# EAGLE design esp_switch (EAGLE 8.0.2)
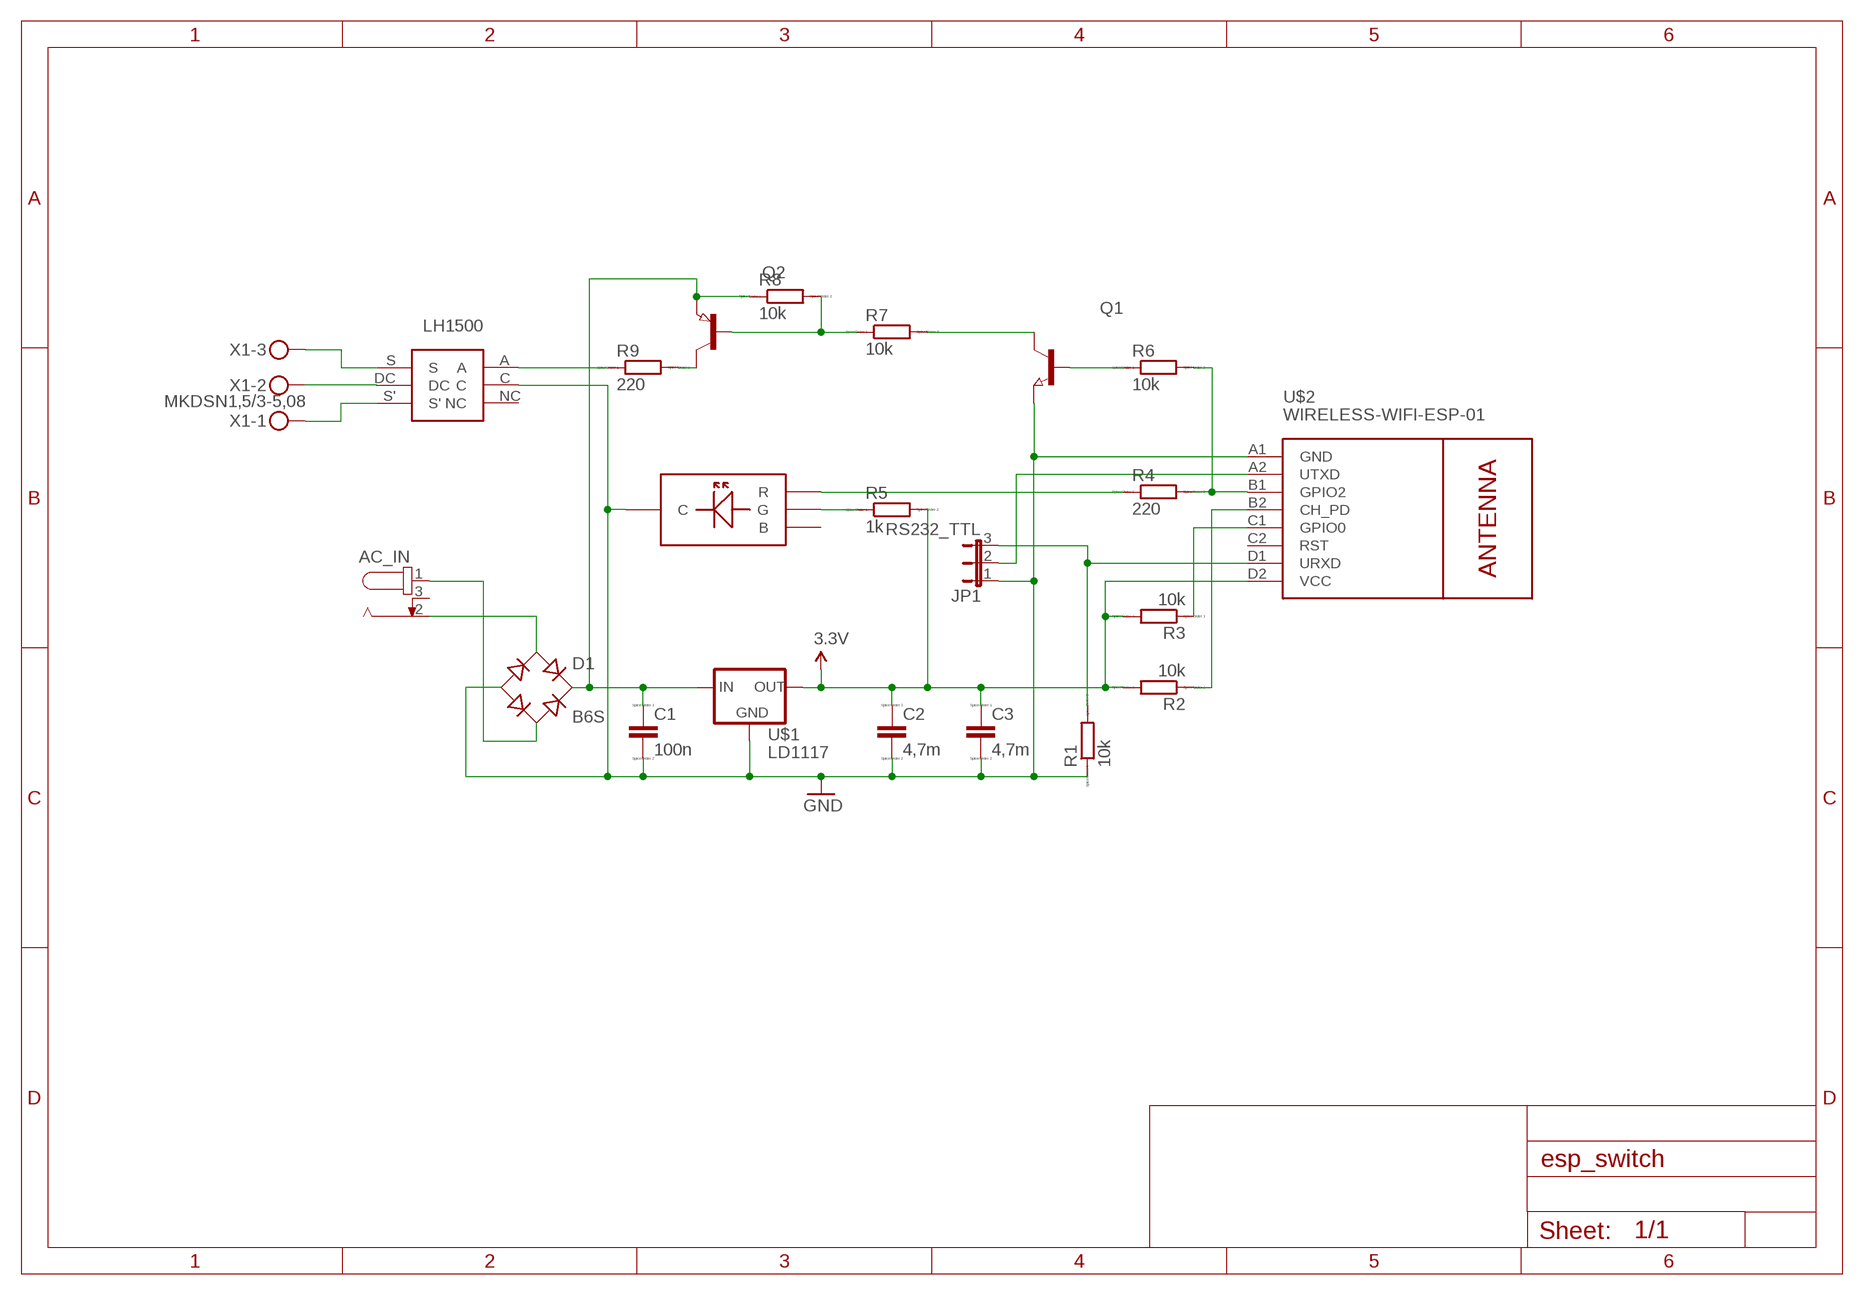
[diagram p0: schematic, sheet 1]

## Parts
AC_IN  694108301002  [694108301002]
C1  100n  C  [C0805]
C2  4,7m  C  [C0805]
C3  4,7m  C  [C0805]
D1  B6S  [MBS]
JP1  RS232_TTL  JP2E  [JP2]
LH1500  LH1500  [LH1500]
Q1  NPN-TRANSISTOR_SOT23  [SOT23]
Q2  PNP-TRANSISTOR_SOT23  [SOT23]
R1  10k  R  [R0805]
R2  10k  R  [R0805]
R3  10k  R  [R0805]
R4  220  R  [R0805]
R5  1k  R  [R0805]
R6  10k  R  [R0805]
R7  10k  R  [R0805]
R8  10k  R  [R0805]
R9  220  R  [R0805]
RGBLED5MM  RGB_LEDA  [RGB_LED]
U$1  LD1117  [LD1117]
U$2  WIRELESS-WIFI-ESP-01  [WIRELESS-WIFI-ESP-01]
X1  MKDSN1,5/3-5,08  [MKDSN1,5/3-5,08]

## Nets
3.3V: C2.1 C3.1 R2.2 R3.2 R5.2 U$1.OUT U$2.D2(VCC)
GND: C1.2 C2.2 C3.2 D1.- JP1.1 LH1500.C Q1.2(E) R1.1 RGBLED5MM.P$3(C) U$1.GND U$2.A1(GND)
N$1: AC_IN.2 D1.AC1
N$2: LH1500.S X1.3
N$3: AC_IN.1 D1.AC2
N$4: JP1.3 R1.2 U$2.D1(URXD)
N$5: JP1.2 U$2.A2(UTXD)
N$6: C1.1 D1.+ Q2.2(E) R8.1 U$1.IN
N$7: LH1500.DC X1.2
N$8: R3.1 U$2.C1(GPIO0)
N$9: R2.1 U$2.B2(CH_PD)
N$10: R4.2 R6.2 U$2.B1(GPIO2)
N$11: R5.1 RGBLED5MM.P$2(G)
N$12: R4.1 RGBLED5MM.P$4(R)
N$13: Q2.3(C) R9.2
N$14: LH1500.S' X1.1
N$15: Q2.1(B) R7.1 R8.2
N$16: Q1.3(C) R7.2
N$17: Q1.1(B) R6.1
N$18: LH1500.A R9.1
Unconnected: AC_IN.3 LH1500.NC RGBLED5MM.P$1(B) U$2.C2(RST)

## Library data of the parts
AC_IN = Wurth_Elektronik_Electromechanic_DC_Power_Jack_Connectors_rev16a_covek:694108301002: WR-DC_DC Power Jack_Right Angled_THT Center Pin Ø2.5_Plug ID Ø2.05_Plug OD Ø5.5 ;=>Code : Con_WR-DC_THT_694108301002_694108301002 <http://katalog.we-online.de/media/images/eican/Con_WR-DC_THT_694108301002_pf2.jpg> Details see: http://katalog.we-online.de/em/datasheet/6941xx301002.pdf Created 2014-10-08, Karrer Zheng 2014 (C) Wurth Elektronik
C1-C3 = eagle-ltspice:C: CAPACITOR, European symbol; SPICEMODEL: NONE; SPICEPREFIX: C
D1 = rectifier:B*S: Surface Mount Glass Passivated Bridge Rectifiers Source: Comchip Bridge Rectifiers B05S-G_B10S-G.pdf
JP1 = jumper:JP2E: JUMPER
LH1500 = LH1500:LH1500
Q1 = semicon-smd-ipc:NPN-TRANSISTOR_: NPN TRANSISTOR
Q2 = semicon-smd-ipc:PNP-TRANSISTOR_: PNP TRANSISTOR
R1-R9 = eagle-ltspice:R: RESISTOR, European symbol; SPICEMODEL: NONE; SPICEPREFIX: R
RGBLED5MM = covek:RGB_LED
U$1 = LD1117:LD1117
U$2 = diy-modules:WIRELESS-WIFI-ESP-01: Wireless Wi-Fi ESP-01 Module based on ESP8266 chip Click here to find device on ebay.com <http://www.ebay.com/sch/esp8266+esp+01+transceiver>
X1 = con-phoenix-508:MKDSN1,5/3-5,08: MKDSN 1,5/ 3-5,08 Printklemme Nennstrom: 13,5 A Nennspannung: 250 V Rastermaß: 5,08 mm Polzahl: 3 Anschlussart: Schraubanschluss Montage: Löten Anschlussrichtung Leiter/Platine: 0 ° Artikelnummer: 1729131 Source: http://eshop.phoenixcontact.com .. 1729131.pdf

## Board
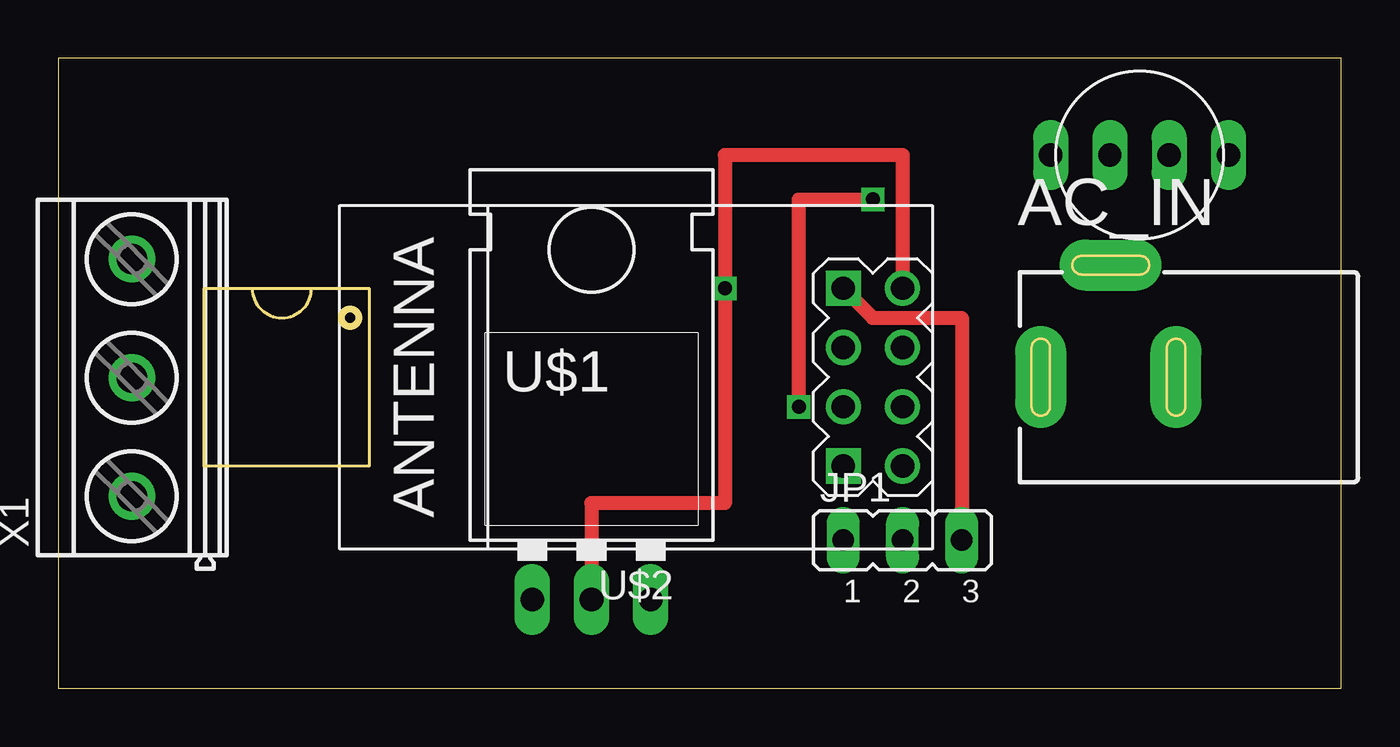
[diagram p1: board, top side]
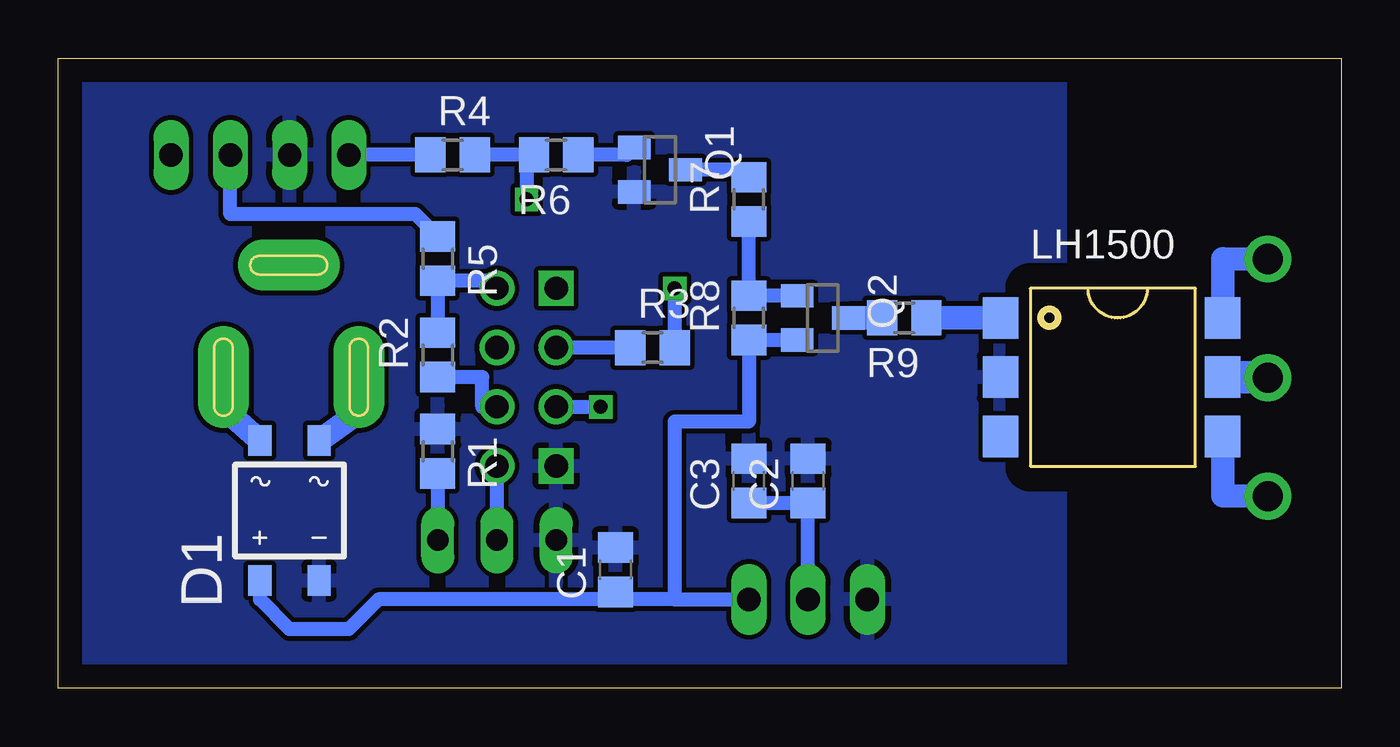
[diagram p2: board, bottom side, seen from below]

Size 55 x 27 mm. Coordinates in mm from the lower left corner, seen from the top.
Outline: 0,0 55,0 55,27 0,27 0,0
Copper layers (1*16): Top 0.035mm / dielectric 1.5mm / Bottom 0.035mm
Design rules "default": minimum track width 10mil, minimum drill 24mil, track to track 8mil, track to pad 8mil, pad to pad 8mil, via to via 8mil, smd to smd 8mil, copper to edge 40mil, drill to drill 8mil, minimum pad ring 10mil, minimum via ring 8mil, stop-mask expansion 4mil, vias tented up to drill 0mil, thermal gap 10mil

### Footprints (pad centres in the part's own frame; a part is rotated, then mirrored left to right if it is on the bottom)
694108301002 = drill 0 pad 2.184 long: 1 -13.6,0; 2 -7.8,0; 3 -10.6,4.8
C0805 = smd 1.3 x 1.5: 1 -0.95,0; 2 0.95,0
MBS = smd 1 x 1.3: + -1.27,-3; - 1.27,-3; AC1 -1.27,3; AC2 1.27,3
JP2 = drill 0.914 long: 1 -2.54,0; 2 0,0; 3 2.54,0
LH1500 = smd 1.52 x 1.78: A 0,0; C 0,-2.54; DC 9.52,-2.54; NC 0,-5.08; S 9.52,0; S' 9.52,-5.08
SOT23 = smd 1 x 1.4: 1 -0.95,-1.1; 2 0.95,-1.1; 3 0,1.1
R0805 = smd 1.3 x 1.5: 1 -0.95,0; 2 0.95,0
RGB_LED = drill 1 long: P$1 -3.81,0; P$2 -1.27,0; P$3 1.27,0; P$4 3.81,0
LD1117 = drill 1.016 long: GND -2.54,-6.35; IN 2.54,-6.35; OUT 0,-6.35
WIRELESS-WIFI-ESP-01 = drill 1 square: A1 -8.89,3.81; D1 -8.89,-3.81 | drill 1: A2 -11.43,3.81; B1 -8.89,1.27; B2 -11.43,1.27; C1 -8.89,-1.27; C2 -11.43,-1.27; D2 -11.43,-3.81
MKDSN1,5/3-5,08 = drill 1.3 pad 2: 1 -7.641,0.025; 2 -2.561,0.025; 3 2.519,0.025

### Placement (x,y rotation side)
AC_IN  55.72,13.34 0 top
C1  31.11,5.08 90 bottom
C2  22.86,8.89 90 bottom
C3  25.4,8.89 90 bottom
D1  45.09,7.62 0 bottom
JP1  36.2,6.35 0 top
LH1500  14.61,15.88 0 bottom
Q1  29.21,22.23 270 bottom
Q2  22.23,15.88 270 bottom
R1  38.73,10.16 270 bottom
R2  38.73,14.29 90 bottom
R3  29.53,14.61 0 bottom
R4  38.1,22.86 0 bottom
R5  38.73,18.41 270 bottom
R6  33.66,22.86 180 bottom
R7  25.4,20.95 90 bottom
R8  25.4,15.88 90 bottom
R9  18.73,15.88 180 bottom
RGBLED5MM  46.35,22.86 180 top
U$1  22.86,10.16 0 top
U$2  24.77,13.34 180 top
X1  3.17,15.88 90 top

### Tracks (layer width: path | path; a pad name or v marks a point on that pad's centre or on a via)
3.3V  (via drill 0.6)
  Top 0.61: U$2.D2 36.2,22.86 28.57,22.86 v28.57,17.14 28.57,7.94 C2.1 U$1.OUT
  Bottom 0.61: C3.1 C2.1 U$1.OUT | U$2.D2 36.52,17.46 R5.2 R2.2 | v28.57,17.14 R3.2
GND
  pour Bottom: 12.06,26.67 12.06,0 54.61,0 54.61,1.27 54.61,26.67
N$1
  Bottom 0.406: AC_IN.2 47.62,13.34 47.62,11.75
  Bottom 1.016: 47.62,11.75 D1.AC1
N$2
  Bottom 1.016: X1.3 5.08,18.41 LH1500.S
N$3
  Bottom 0.406: AC_IN.1 42.23,13.34 42.23,11.75
  Bottom 1.016: 42.23,11.75 D1.AC2
N$4
  Top 0.61: U$2.D1 34.92,15.88 38.73,15.88 JP1.3
  Bottom 0.61: R1.2 JP1.3
N$5
  Bottom 0.61: JP1.2 U$2.A2
N$6
  Bottom 0.61: Q2.2 R8.1 25.4,11.43 28.57,11.43 28.57,3.81 | 28.57,3.81 U$1.IN | 28.57,3.81 30.48,3.81 30.8,4.13 C1.1 31.43,3.81 41.27,3.81 42.55,2.54 45.09,2.54 46.35,3.81 D1.+
N$7
  Bottom 1.422: X1.2 LH1500.DC
N$8
  Bottom 0.61: R3.1 U$2.C1
N$9
  Bottom 0.61: U$2.B2 36.83,12.06 36.83,13.34 R2.1
N$10  (via drill 0.6)
  Top 0.61: v31.75,12.06 31.75,20.95 v34.92,20.95
  Bottom 0.61: U$2.B1 v31.75,12.06 | v34.92,20.95 34.92,22.54 R6.2 R4.2
N$11
  Bottom 0.61: R5.1 39.69,20.32 47.62,20.32 RGBLED5MM.P$2
N$12
  Bottom 0.61: R4.1 RGBLED5MM.P$4
N$13
  Bottom 1.016: R9.2 Q2.3
N$14
  Bottom 1.016: LH1500.S' 5.08,8.26 X1.1
N$15
  Bottom 0.61: Q2.1 R8.2 R7.1
N$16
  Bottom 0.61: R7.2 25.72,22.23 Q1.3
N$17
  Bottom 0.61: Q1.1 30.62,22.86 R6.1
N$18
  Bottom 1.016: LH1500.A R9.1